# Altium schematic sheet ADC_Connections.SchDoc
size A3
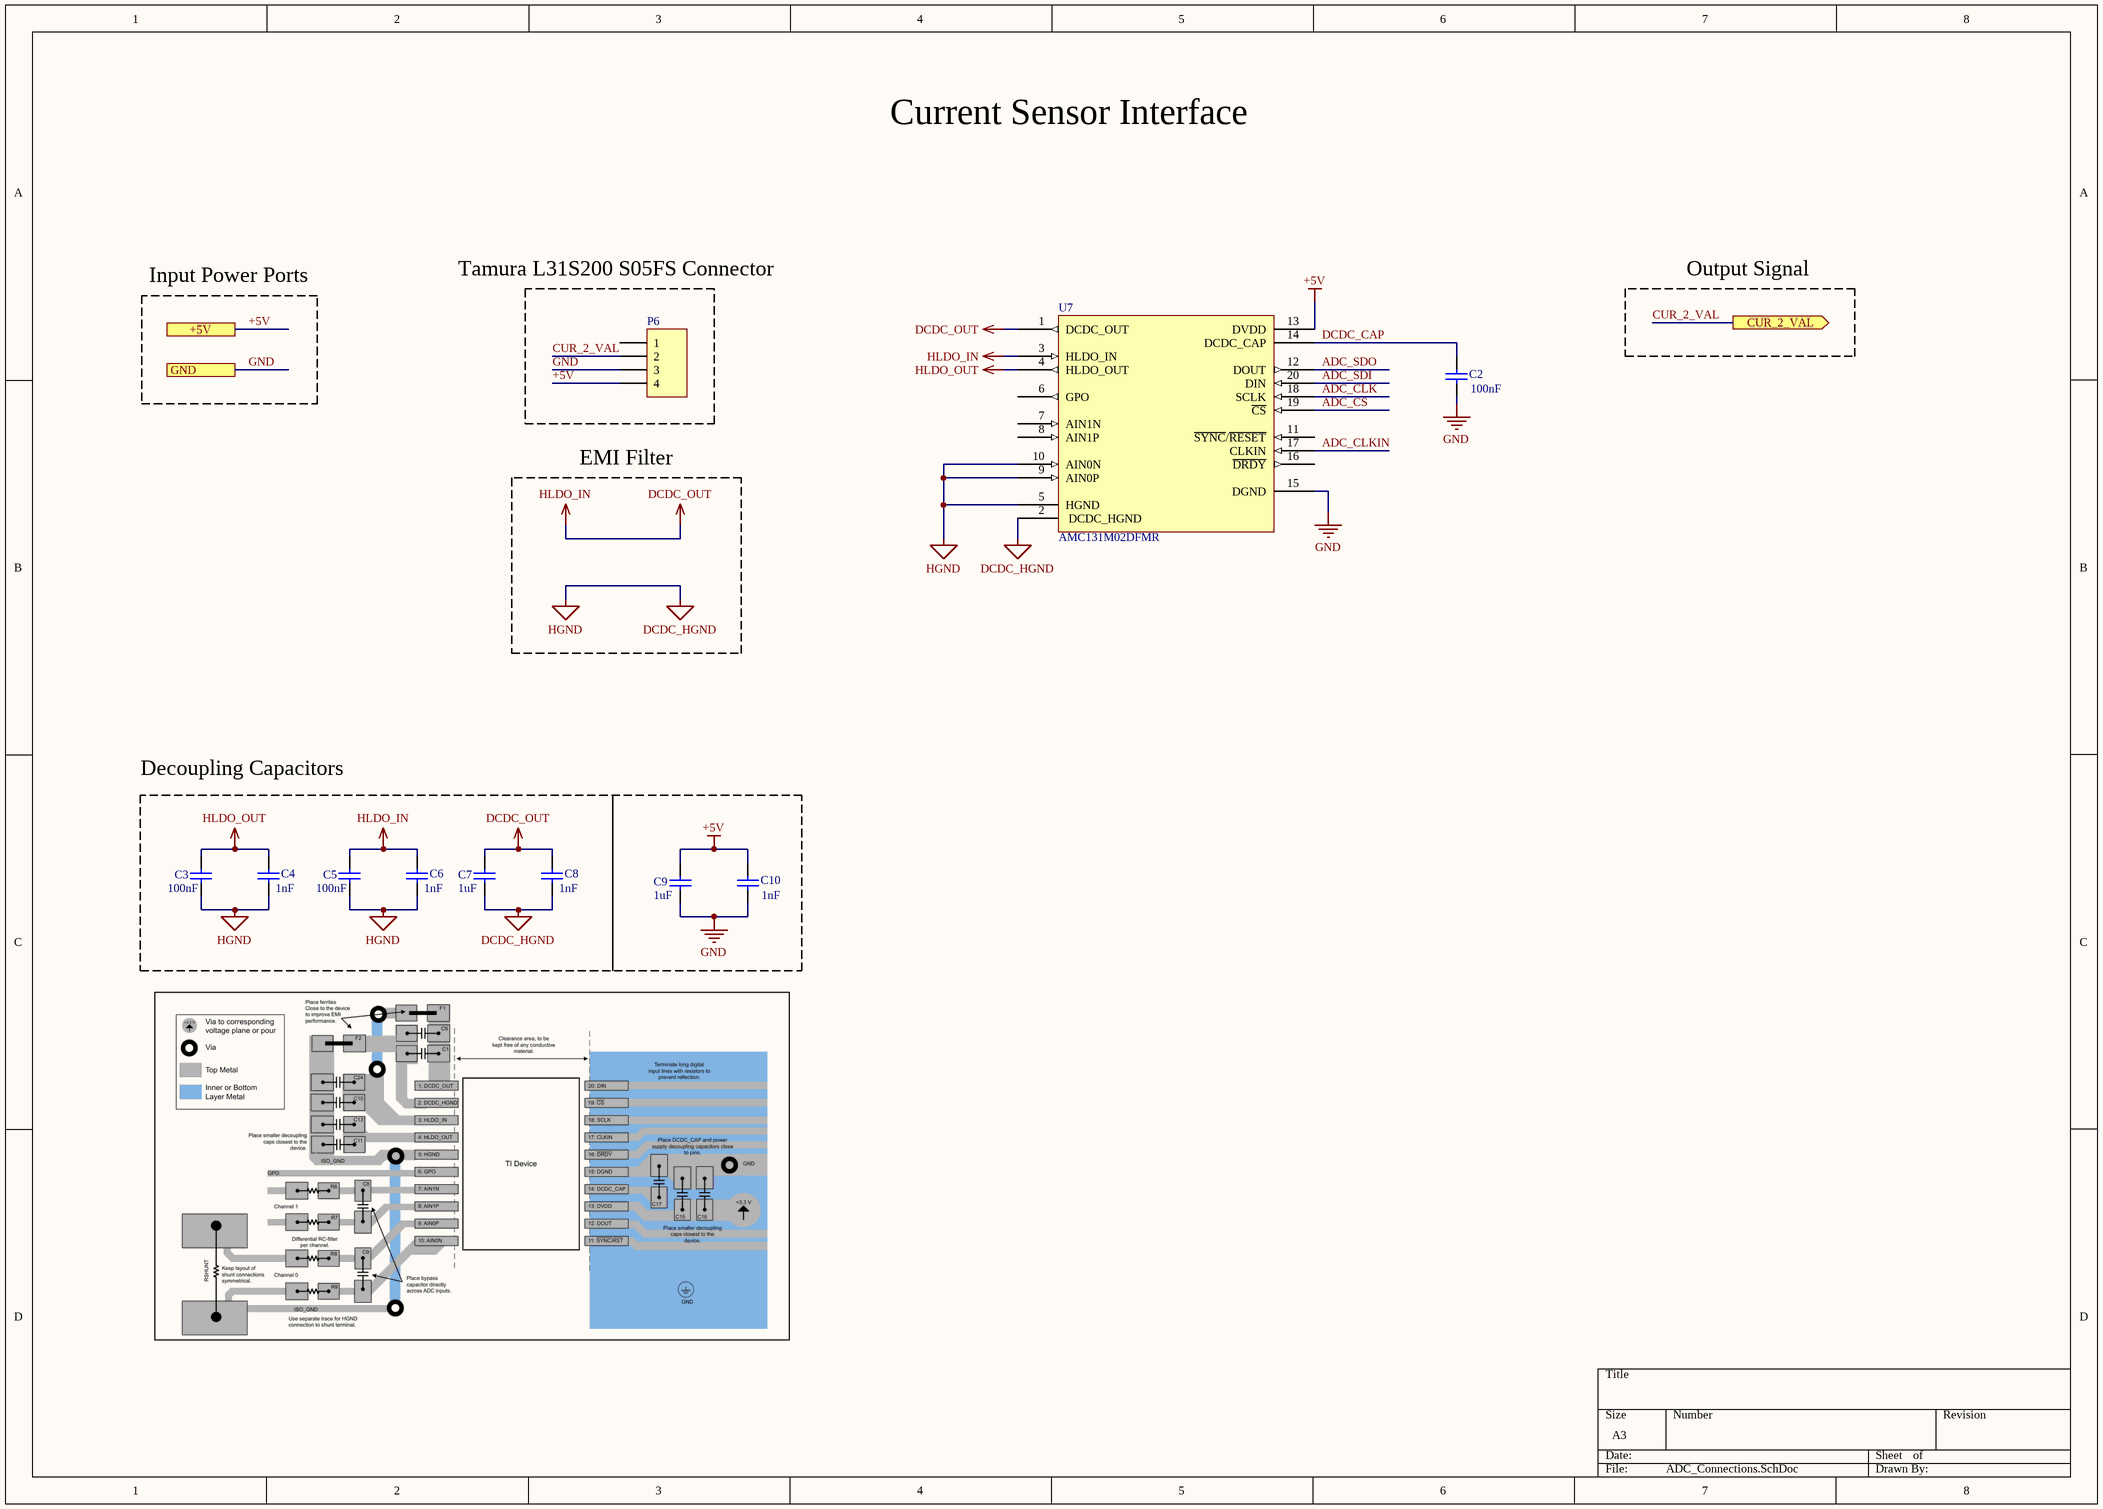
[diagram p0: ADC_Connections.SchDoc]

## Parts
C2  value 100nF  [RAD-0.3]  (hidden comment: Cap)
C3  value 100nF  [RAD-0.3]  (hidden comment: Cap)
C4  value 1nF  [RAD-0.3]  (hidden comment: Cap)
C5  value 100nF  [RAD-0.3]  (hidden comment: Cap)
C6  value 1nF  [RAD-0.3]  (hidden comment: Cap)
C7  value 1uF  [RAD-0.3]  (hidden comment: Cap)
C8  value 1nF  [RAD-0.3]  (hidden comment: Cap)
C9  value 1uF  [RAD-0.3]  (hidden comment: Cap)
C10  value 1nF  [RAD-0.3]  (hidden comment: Cap)
P6  Header 4  [HDR1X4]  (value not drawn)
U7  AMC131M02DFMR  [SOIC20]

## Blocks framed on the sheet
Decoupling Capacitors: C3-C10

## Ports
+5V, CUR_2_VAL (out), GND

## Nets
+5V: C9.2 C10.2 P6.4 U7.13(DVDD) ; port +5V
DCDC_HGND: C3.1 C4.1 C5.1 C6.1 C7.1 C8.1 U7.2(DCDC_HGND) U7.5(HGND) U7.9(AIN0P) U7.10(AIN0N)  [also labelled HGND]
DCDC_OUT: C5.2 C6.2 C7.2 C8.2 U7.1(DCDC_OUT) U7.3(HLDO_IN)  [also labelled HLDO_IN]
GND: C2.1 C9.1 C10.1 P6.3 U7.15(DGND) ; port GND
HLDO_OUT: C3.2 C4.2 U7.4(HLDO_OUT)
ADC_CLK: U7.18(SCLK)
ADC_CLKIN: U7.17(CLKIN)
ADC_CS: U7.19(~{CS})
ADC_SDI: U7.20(DIN)
ADC_SDO: U7.12(DOUT)
CUR_2_VAL: P6.2 ; port CUR_2_VAL
DCDC_CAP: C2.2 U7.14(DCDC_CAP)

Not connected (* = marked no-connect by the designer): P6 1; U7 6(GPO) 7(AIN1N) 8(AIN1P) 11(~{SYNC}/~{RESET}) 16(~{DRDY})

## Notes on the sheet
- Current Sensor Interface
- Input Power Ports
- Tamura L31S200 S05FS Connector
- Output Signal
- EMI Filter

## Library data of the parts
C2-C10 = Cap: Capacitor; Published: 8-Jun-2000; LatestRevisionDate: 17-Jul-2002; LatestRevisionNote: Re-released for DXP Platform.; PackageReference: RAD-0.3; Publisher: Altium Limited; PackageDescription: Radial Cap, Thru-Hole; 2 Leads; 0.3 in Pin Spacing
P6 = CMP-002-00168-1: Header, 4-Pin; Signal Integrity: Connector; Source: Miscellaneous Connectors.SchLib; LatestRevisionDate: 17-Jul-2002; Publisher: Altium Limited; Pins: 4; Component Type: Standard; LatestRevisionNote: Re-released for DXP Platform.; Design Item ID: Header 4
U7 = AMC131M02DFMR: Precision, two-channel, data- / and power-isolated, simultaneous-sampling, 24-bit, delta-sigma (ΔΣ), analog-to-digital converter (ADC).